# EAGLE design programming-adapter-1edge (EAGLE 7.3.0)
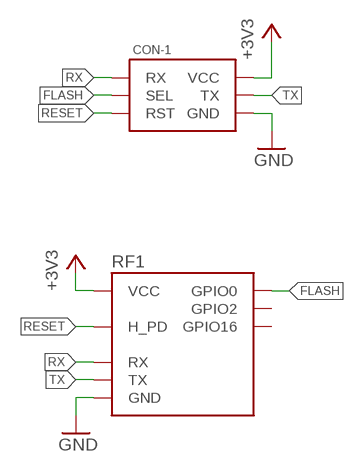
[diagram p0: schematic, sheet 1]

## Parts
CON-1  ESP8266-6_PIN-EDGE  [EDGE-6_PIN]
RF1  ESP2866-ESP-01THT-NOSILK  [ESP8266-ESP-01-NOSILK]

## Nets
+3V3: CON-1.2(VCC) RF1.VCC
FLASH: CON-1.3(SEL) RF1.GPIO0
GND: CON-1.6(GND) RF1.GND
RESET: CON-1.5(RST) RF1.H_PD
RX: CON-1.1(RX) RF1.RX
TX: CON-1.4(TX) RF1.TX
Unconnected: RF1.GPIO2 RF1.GPIO16

## Library data of the parts
CON-1 = p.peter-connectors:ESP8266-6_PIN
RF1 = p.peter-periphery:ESP2866-ESP-01

## Board
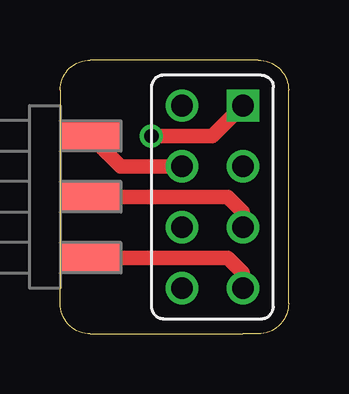
[diagram p1: board, top side]
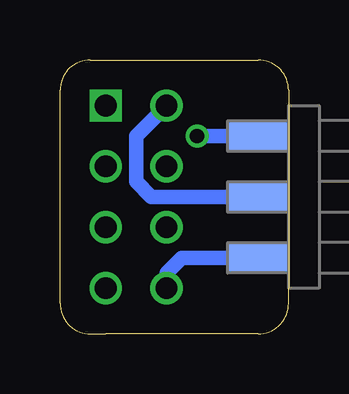
[diagram p2: board, bottom side, seen from below]

Size 9.53 x 11.43 mm. Coordinates in mm from the lower left corner, seen from the top.
Outline: 1.27,0 7.62,0 8.25,0 arc90 9.53,1.27 9.53,10.16 arc90 8.25,11.43 1.27,11.43 arc90 0,10.16 0,1.91 0,1.27 arc90 1.27,0
Copper layers (1*16): Top 0.0356mm / dielectric 1.5011mm / Bottom 0.0356mm
Design rules "oshpark": minimum track width 6mil, minimum drill 13mil, track to track 6mil, track to pad 6mil, pad to pad 6mil, via to via 6mil, smd to smd 6mil, copper to edge 15mil, drill to drill 6mil, minimum pad ring 7mil, minimum via ring 7mil, stop-mask expansion 4mil, vias tented up to drill 4.1mm, thermal gap 10mil

### Footprints (pad centres in the part's own frame; a part is rotated, then mirrored left to right if it is on the bottom)
EDGE-6_PIN = smd 1.27 x 2.54: 1 2.54,0; 3 0,0; 5 -2.54,0 | smd 1.27 x 2.54 bottom: 2 2.54,0; 4 0,0; 6 -2.54,0
ESP8266-ESP-01-NOSILK = drill 0.9 square: GND 1.27,3.81 | drill 0.9: GPIO0 1.27,-1.27; GPIO2 1.27,1.27; GPIO16 -1.27,-1.27; H_PD -1.27,1.27; RX 1.27,-3.81; TX -1.27,3.81; VCC -1.27,-3.81

### Placement (x,y rotation side)
CON-1  1.27,5.71 270 top
RF1  6.35,5.71 0 top

### Tracks (layer width: path | path; a pad name or v marks a point on that pad's centre or on a via)
+3V3
  Bottom 0.61: CON-1.2 4.45,3.17 5.08,2.54 RF1.VCC
FLASH
  Top 0.61: CON-1.3 6.98,5.71 7.62,5.08 RF1.GPIO0
GND  (via drill 0.6)
  Top 0.61: v3.81,8.26 6.35,8.26 RF1.GND
  Bottom 0.61: CON-1.6 v3.81,8.26
RESET
  Top 0.61: RF1.H_PD 2.54,6.99 CON-1.5
RX
  Top 0.61: CON-1.1 6.98,3.17 7.62,2.54 RF1.RX
TX
  Bottom 0.61: CON-1.4 5.71,5.71 6.35,6.35 6.35,6.99 6.35,8.26 RF1.TX